# EAGLE schematic ground_controller (EAGLE 6.5.0)
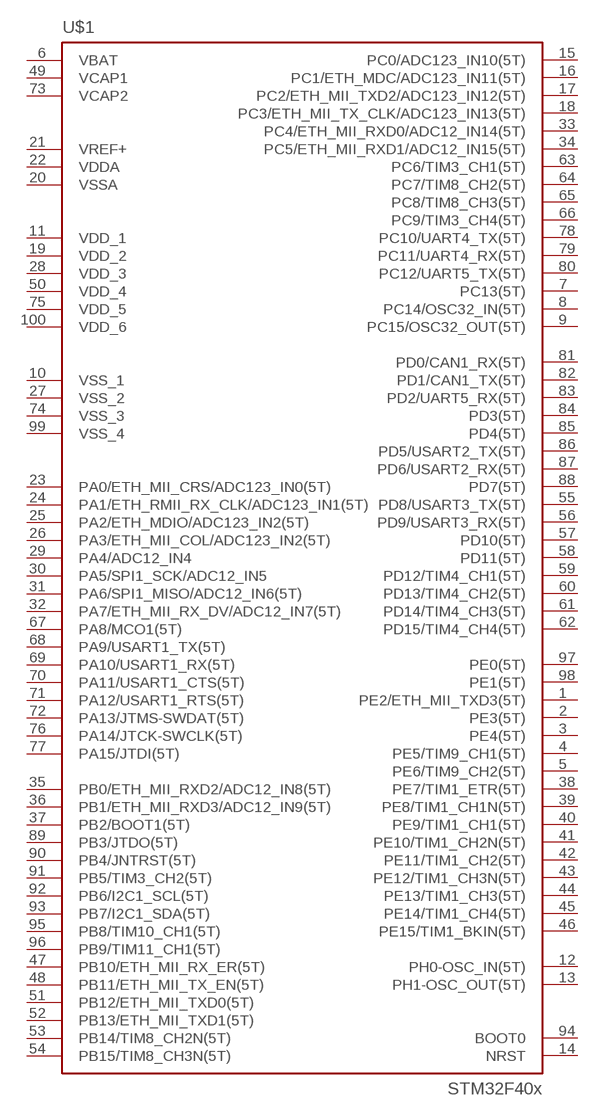
[diagram p0: schematic, sheet 1]

## Parts
U$1  STM32F407V  [TQFP100]
Unconnected: U$1.1(PE2/ETH_MII_TXD3(5T)) U$1.2(PE3(5T)) U$1.3(PE4(5T)) U$1.4(PE5/TIM9_CH1(5T)) U$1.5(PE6/TIM9_CH2(5T)) U$1.6(VBAT) U$1.7(PC13(5T)) U$1.8(PC14/OSC32_IN(5T)) U$1.9(PC15/OSC32_OUT(5T)) U$1.10(VSS_1) U$1.11(VDD_1) U$1.12(PH0-OSC_IN(5T)) U$1.13(PH1-OSC_OUT(5T)) U$1.14(NRST) U$1.15(PC0/ADC123_IN10(5T)) U$1.16(PC1/ETH_MDC/ADC123_IN11(5T)) U$1.17(PC2/ETH_MII_TXD2/ADC123_IN12(5T)) U$1.18(PC3/ETH_MII_TX_CLK/ADC123_IN13(5T)) U$1.19(VDD_2) U$1.20(VSSA) U$1.21(VREF+) U$1.22(VDDA) U$1.23(PA0/ETH_MII_CRS/ADC123_IN0(5T)) U$1.24(PA1/ETH_RMII_RX_CLK/ADC123_IN1(5T)) U$1.25(PA2/ETH_MDIO/ADC123_IN2(5T)) U$1.26(PA3/ETH_MII_COL/ADC123_IN2(5T)) U$1.27(VSS_2) U$1.28(VDD_3) U$1.29(PA4/ADC12_IN4) U$1.30(PA5/SPI1_SCK/ADC12_IN5) U$1.31(PA6/SPI1_MISO/ADC12_IN6(5T)) U$1.32(PA7/ETH_MII_RX_DV/ADC12_IN7(5T)) U$1.33(PC4/ETH_MII_RXD0/ADC12_IN14(5T)) U$1.34(PC5/ETH_MII_RXD1/ADC12_IN15(5T)) U$1.35(PB0/ETH_MII_RXD2/ADC12_IN8(5T)) U$1.36(PB1/ETH_MII_RXD3/ADC12_IN9(5T)) U$1.37(PB2/BOOT1(5T)) U$1.38(PE7/TIM1_ETR(5T)) U$1.39(PE8/TIM1_CH1N(5T)) U$1.40(PE9/TIM1_CH1(5T)) U$1.41(PE10/TIM1_CH2N(5T)) U$1.42(PE11/TIM1_CH2(5T)) U$1.43(PE12/TIM1_CH3N(5T)) U$1.44(PE13/TIM1_CH3(5T)) U$1.45(PE14/TIM1_CH4(5T)) U$1.46(PE15/TIM1_BKIN(5T)) U$1.47(PB10/ETH_MII_RX_ER(5T)) U$1.48(PB11/ETH_MII_TX_EN(5T)) U$1.49(VCAP1) U$1.50(VDD_4) U$1.51(PB12/ETH_MII_TXD0(5T)) U$1.52(PB13/ETH_MII_TXD1(5T)) U$1.53(PB14/TIM8_CH2N(5T)) U$1.54(PB15/TIM8_CH3N(5T)) U$1.55(PD8/USART3_TX(5T)) U$1.56(PD9/USART3_RX(5T)) U$1.57(PD10(5T)) U$1.58(PD11(5T)) U$1.59(PD12/TIM4_CH1(5T)) U$1.60(PD13/TIM4_CH2(5T)) U$1.61(PD14/TIM4_CH3(5T)) U$1.62(PD15/TIM4_CH4(5T)) U$1.63(PC6/TIM3_CH1(5T)) U$1.64(PC7/TIM8_CH2(5T)) U$1.65(PC8/TIM8_CH3(5T)) U$1.66(PC9/TIM3_CH4(5T)) U$1.67(PA8/MCO1(5T)) U$1.68(PA9/USART1_TX(5T)) U$1.69(PA10/USART1_RX(5T)) U$1.70(PA11/USART1_CTS(5T)) U$1.71(PA12/USART1_RTS(5T)) U$1.72(PA13/JTMS-SWDAT(5T)) U$1.73(VCAP2) U$1.74(VSS_3) U$1.75(VDD_5) U$1.76(PA14/JTCK-SWCLK(5T)) U$1.77(PA15/JTDI(5T)) U$1.78(PC10/UART4_TX(5T)) U$1.79(PC11/UART4_RX(5T)) U$1.80(PC12/UART5_TX(5T)) U$1.81(PD0/CAN1_RX(5T)) U$1.82(PD1/CAN1_TX(5T)) U$1.83(PD2/UART5_RX(5T)) U$1.84(PD3(5T)) U$1.85(PD4(5T)) U$1.86(PD5/USART2_TX(5T)) U$1.87(PD6/USART2_RX(5T)) U$1.88(PD7(5T)) U$1.89(PB3/JTDO(5T)) U$1.90(PB4/JNTRST(5T)) U$1.91(PB5/TIM3_CH2(5T)) U$1.92(PB6/I2C1_SCL(5T)) U$1.93(PB7/I2C1_SDA(5T)) U$1.94(BOOT0) U$1.95(PB8/TIM10_CH1(5T)) U$1.96(PB9/TIM11_CH1(5T)) U$1.97(PE0(5T)) U$1.98(PE1(5T)) U$1.99(VSS_4) U$1.100(VDD_6)

## Library data of the parts
U$1 = stm32f4:STM32F407V: STM32F407 100 pin LQFP reviewed: YES tested: YES